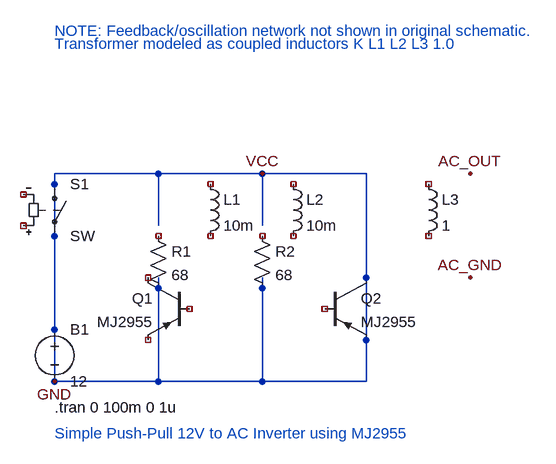
[diagram p0: schematic 30-simple-inverter_generated-by-claude-sonnet-4-6.asc]
30-simple-inverter_generated-by-claude-sonnet-4-6.asc, the LTspice schematic file:
Version 4
SHEET 1 880 680
WIRE 80 480 80 560
WIRE 80 400 80 480
WIRE 80 320 80 400
WIRE 80 240 80 320
WIRE 80 240 240 240
WIRE 240 240 400 240
WIRE 400 240 560 240
WIRE 560 240 560 320
WIRE 560 320 560 400
WIRE 560 400 560 480
WIRE 560 480 560 560
WIRE 80 560 240 560
WIRE 240 560 400 560
WIRE 400 560 560 560
WIRE 240 240 240 320
WIRE 400 240 400 320
WIRE 240 400 240 560
WIRE 400 400 400 560
FLAG 80 560 GND
FLAG 400 240 VCC
FLAG 720 240 AC_OUT
FLAG 720 400 AC_GND
SYMBOL voltage 80 464 R0
SYMATTR InstName B1
SYMATTR Value 12
SYMBOL sw 80 240 R0
SYMATTR InstName S1
SYMATTR Value SW
SYMBOL res 224 320 R0
SYMATTR InstName R1
SYMATTR Value 68
SYMBOL res 384 320 R0
SYMATTR InstName R2
SYMATTR Value 68
SYMBOL pnp 288 400 M0
SYMATTR InstName Q1
SYMATTR Value MJ2955
SYMBOL pnp 496 400 R0
SYMATTR InstName Q2
SYMATTR Value MJ2955
SYMBOL ind 304 240 R0
SYMATTR InstName L1
SYMATTR Value 10m
SYMATTR SpiceLine Rser=0.1
SYMBOL ind 432 240 R0
SYMATTR InstName L2
SYMATTR Value 10m
SYMATTR SpiceLine Rser=0.1
SYMBOL ind 640 240 R0
SYMATTR InstName L3
SYMATTR Value 1
SYMATTR SpiceLine Rser=1
TEXT 80 600 Left 2 !.tran 0 100m 0 1u
TEXT 80 640 Left 2 ;Simple Push-Pull 12V to AC Inverter using MJ2955
TEXT 80 20 Left 2 ;NOTE: Feedback/oscillation network not shown in original schematic.
TEXT 80 40 Left 2 ;Transformer modeled as coupled inductors K L1 L2 L3 1.0

The netlist it stands for:
* 30-simple-inverter_generated-by-claude-sonnet-4-6.asc
V§B1 VCC VCC 12
S1 VCC VCC NC_01 NC_02 SW
R1 NC_03 VCC 68
R2 NC_04 VCC 68
* Q1: MJ2955 (symbol pnp not certain, pin order unknown); nets seen at it: 0
Q2 VCC NC_08 VCC 0 MJ2955
L1 NC_09 NC_10 10m Rser=0.1
L2 NC_11 NC_12 10m Rser=0.1
L3 NC_13 NC_14 1 Rser=1
.model NPN NPN
.model PNP PNP
.lib standard.bjt
.tran 0 100m 0 1u
* Simple Push-Pull 12V to AC Inverter using MJ2955
* NOTE: Feedback/oscillation network not shown in original schematic.
* Transformer modeled as coupled inductors K L1 L2 L3 1.0
.backanno
.end